# EAGLE design B166X (EAGLE 6.6.0)
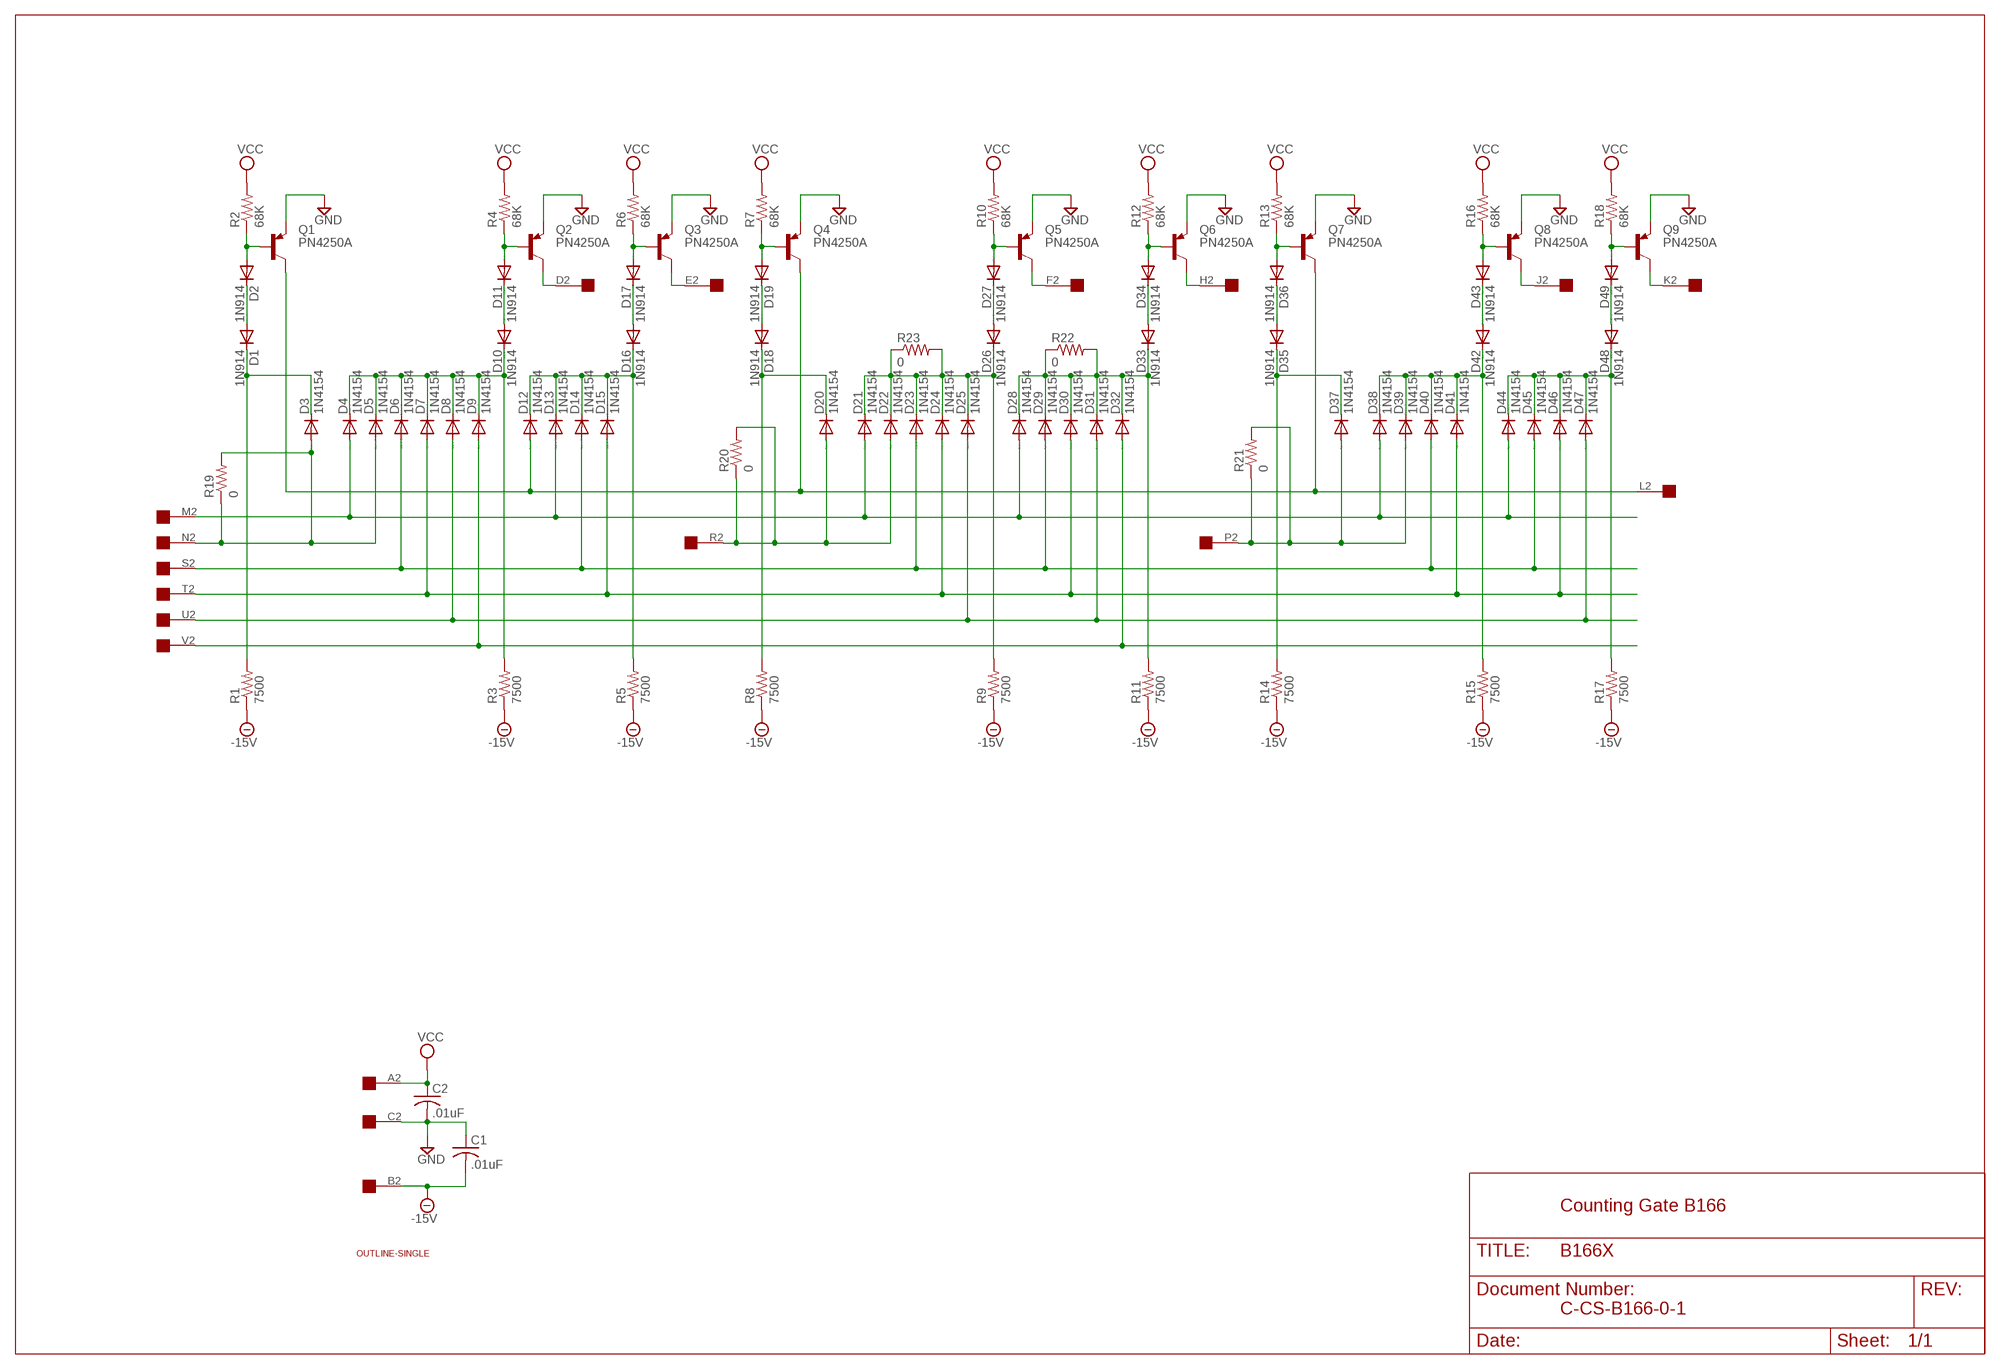
[diagram p0: schematic, sheet 1]

## Parts
C1  .01uF  C-US  [C063-025X075]
C2  .01uF  C-US  [C063-025X075]
D1  1N914  DIODE-DO35-10  [DO35-10]
D2  1N914  DIODE-DO35-10  [DO35-10]
D3  1N4154  DIODE-DO35-10  [DO35-10]
D4  1N4154  DIODE-DO35-10  [DO35-10]
D5  1N4154  DIODE-DO35-10  [DO35-10]
D6  1N4154  DIODE-DO35-10  [DO35-10]
D7  1N4154  DIODE-DO35-10  [DO35-10]
D8  1N4154  DIODE-DO35-10  [DO35-10]
D9  1N4154  DIODE-DO35-10  [DO35-10]
D10  1N914  DIODE-DO35-10  [DO35-10]
D11  1N914  DIODE-DO35-10  [DO35-10]
D12  1N4154  DIODE-DO35-10  [DO35-10]
D13  1N4154  DIODE-DO35-10  [DO35-10]
D14  1N4154  DIODE-DO35-10  [DO35-10]
D15  1N4154  DIODE-DO35-10  [DO35-10]
D16  1N914  DIODE-DO35-10  [DO35-10]
D17  1N914  DIODE-DO35-10  [DO35-10]
D18  1N914  DIODE-DO35-10  [DO35-10]
D19  1N914  DIODE-DO35-10  [DO35-10]
D20  1N4154  DIODE-DO35-10  [DO35-10]
D21  1N4154  DIODE-DO35-10  [DO35-10]
D22  1N4154  DIODE-DO35-10  [DO35-10]
D23  1N4154  DIODE-DO35-10  [DO35-10]
D24  1N4154  DIODE-DO35-10  [DO35-10]
D25  1N4154  DIODE-DO35-10  [DO35-10]
D26  1N914  DIODE-DO35-10  [DO35-10]
D27  1N914  DIODE-DO35-10  [DO35-10]
D28  1N4154  DIODE-DO35-10  [DO35-10]
D29  1N4154  DIODE-DO35-10  [DO35-10]
D30  1N4154  DIODE-DO35-10  [DO35-10]
D31  1N4154  DIODE-DO35-10  [DO35-10]
D32  1N4154  DIODE-DO35-10  [DO35-10]
D33  1N914  DIODE-DO35-10  [DO35-10]
D34  1N914  DIODE-DO35-10  [DO35-10]
D35  1N914  DIODE-DO35-10  [DO35-10]
D36  1N914  DIODE-DO35-10  [DO35-10]
D37  1N4154  DIODE-DO35-10  [DO35-10]
D38  1N4154  DIODE-DO35-10  [DO35-10]
D39  1N4154  DIODE-DO35-10  [DO35-10]
D40  1N4154  DIODE-DO35-10  [DO35-10]
D41  1N4154  DIODE-DO35-10  [DO35-10]
D42  1N914  DIODE-DO35-10  [DO35-10]
D43  1N914  DIODE-DO35-10  [DO35-10]
D44  1N4154  DIODE-DO35-10  [DO35-10]
D45  1N4154  DIODE-DO35-10  [DO35-10]
D46  1N4154  DIODE-DO35-10  [DO35-10]
D47  1N4154  DIODE-DO35-10  [DO35-10]
D48  1N914  DIODE-DO35-10  [DO35-10]
D49  1N914  DIODE-DO35-10  [DO35-10]
Q1  PN4250A  -PNP-TO5  [TO5]
Q2  PN4250A  -PNP-TO5  [TO5]
Q3  PN4250A  -PNP-TO5  [TO5]
Q4  PN4250A  -PNP-TO5  [TO5]
Q5  PN4250A  -PNP-TO5  [TO5]
Q6  PN4250A  -PNP-TO5  [TO5]
Q7  PN4250A  -PNP-TO5  [TO5]
Q8  PN4250A  -PNP-TO5  [TO5]
Q9  PN4250A  -PNP-TO5  [TO5]
R1  7500  R-US_0207/10  [0207/10]
R2  68K  R-US_0207/10  [0207/10]
R3  7500  R-US_0207/10  [0207/10]
R4  68K  R-US_0207/10  [0207/10]
R5  7500  R-US_0207/10  [0207/10]
R6  68K  R-US_0207/10  [0207/10]
R7  68K  R-US_0207/10  [0207/10]
R8  7500  R-US_0207/10  [0207/10]
R9  7500  R-US_0207/10  [0207/10]
R10  68K  R-US_0207/10  [0207/10]
R11  7500  R-US_0207/10  [0207/10]
R12  68K  R-US_0207/10  [0207/10]
R13  68K  R-US_0207/10  [0207/10]
R14  7500  R-US_0207/10  [0207/10]
R15  7500  R-US_0207/10  [0207/10]
R16  68K  R-US_0207/10  [0207/10]
R17  7500  R-US_0207/10  [0207/10]
R18  68K  R-US_0207/10  [0207/10]
R19  0  R-US_0207/10  [0207/10]
R20  0  R-US_0207/10  [0207/10]
R21  0  R-US_0207/10  [0207/10]
R22  0  R-US_0207/10  [0207/10]
R23  0  R-US_0207/10  [0207/10]
U$1  OUTLINE-SINGLE  [SINGLE]
U$2  EDGE-1  [EDGE-CON1]

## Nets
-15V: C1.2 R1.1 R3.1 R5.1 R8.1 R9.1 R11.1 R14.1 R15.1 R17.1 U$2.B2
GND: C1.1 C2.2 Q1.1(E) Q2.1(E) Q3.1(E) Q4.1(E) Q5.1(E) Q6.1(E) Q7.1(E) Q8.1(E) Q9.1(E) U$2.C2
N$1: D2.A Q1.2(B) R2.1
N$2: D1.A D2.C
N$3: D1.C D3.C R1.2
N$4: D3.A D5.A R19.1 R19.2 U$2.N2
N$5: D4.C D5.C D6.C D7.C D8.C D9.C D10.C R3.2
N$6: D12.A Q1.3(C) Q4.3(C) Q7.3(C) U$2.L2
N$7: D4.A D13.A D21.A D28.A D38.A D44.A U$2.M2
N$8: D8.A D25.A D31.A D47.A U$2.U2
N$9: D7.A D15.A D24.A D30.A D41.A D46.A U$2.T2
N$10: D11.A Q2.2(B) R4.1
N$11: D9.A D32.A U$2.V2
N$12: D6.A D14.A D23.A D29.A D40.A D45.A U$2.S2
N$13: D10.A D11.C
N$14: Q2.3(C) U$2.D2
N$15: D19.A Q4.2(B) R7.1
N$16: D12.C D13.C D14.C D15.C D16.C R5.2
N$17: D18.A D19.C
N$18: D18.C D20.C R8.2
N$19: D20.A D22.A R20.1 R20.2 U$2.R2
N$20: D21.C D22.C D23.C D24.C D25.C D26.C R9.2 R23.1 R23.2
N$23: D17.A Q3.2(B) R6.1
N$24: D16.A D17.C
N$25: Q3.3(C) U$2.E2
N$30: D27.A Q5.2(B) R10.1
N$31: D26.A D27.C
N$32: Q5.3(C) U$2.F2
N$33: D28.C D29.C D30.C D31.C D32.C D33.C R11.2 R22.1 R22.2
N$34: D34.A Q6.2(B) R12.1
N$35: D33.A D34.C
N$36: Q6.3(C) U$2.H2
N$37: D36.A Q7.2(B) R13.1
N$38: D35.A D36.C
N$39: D35.C D37.C R14.2
N$40: D37.A D39.A R21.1 R21.2 U$2.P2
N$41: D38.C D39.C D40.C D41.C D42.C R15.2
N$42: D43.A Q8.2(B) R16.1
N$43: D42.A D43.C
N$44: Q8.3(C) U$2.J2
N$45: D44.C D45.C D46.C D47.C D48.C R17.2
N$46: D49.A Q9.2(B) R18.1
N$47: D48.A D49.C
N$48: Q9.3(C) U$2.K2
VCC: C2.1 R2.2 R4.2 R6.2 R7.2 R10.2 R12.2 R13.2 R16.2 R18.2 U$2.A2

## Notes on the sheet
- Counting Gate B166
- C-CS-B166-0-1

## Library data of the parts
C1 C2 = dec-con:C-US: Capacitors with funky DEC lead spacing.
D1-D49 = diode:DIODE-: DIODE
Q1-Q9 = transistor:*-PNP-: PNP Transistror
R1-R23 = rcl:R-US_: RESISTOR, American symbol
U$1 = dec-con:OUTLINE-*: Board outlines for DEC boards.
U$2 = dec-con:EDGE-1: Single-Sided DEC Edge Connector -- (side 2)

## Board
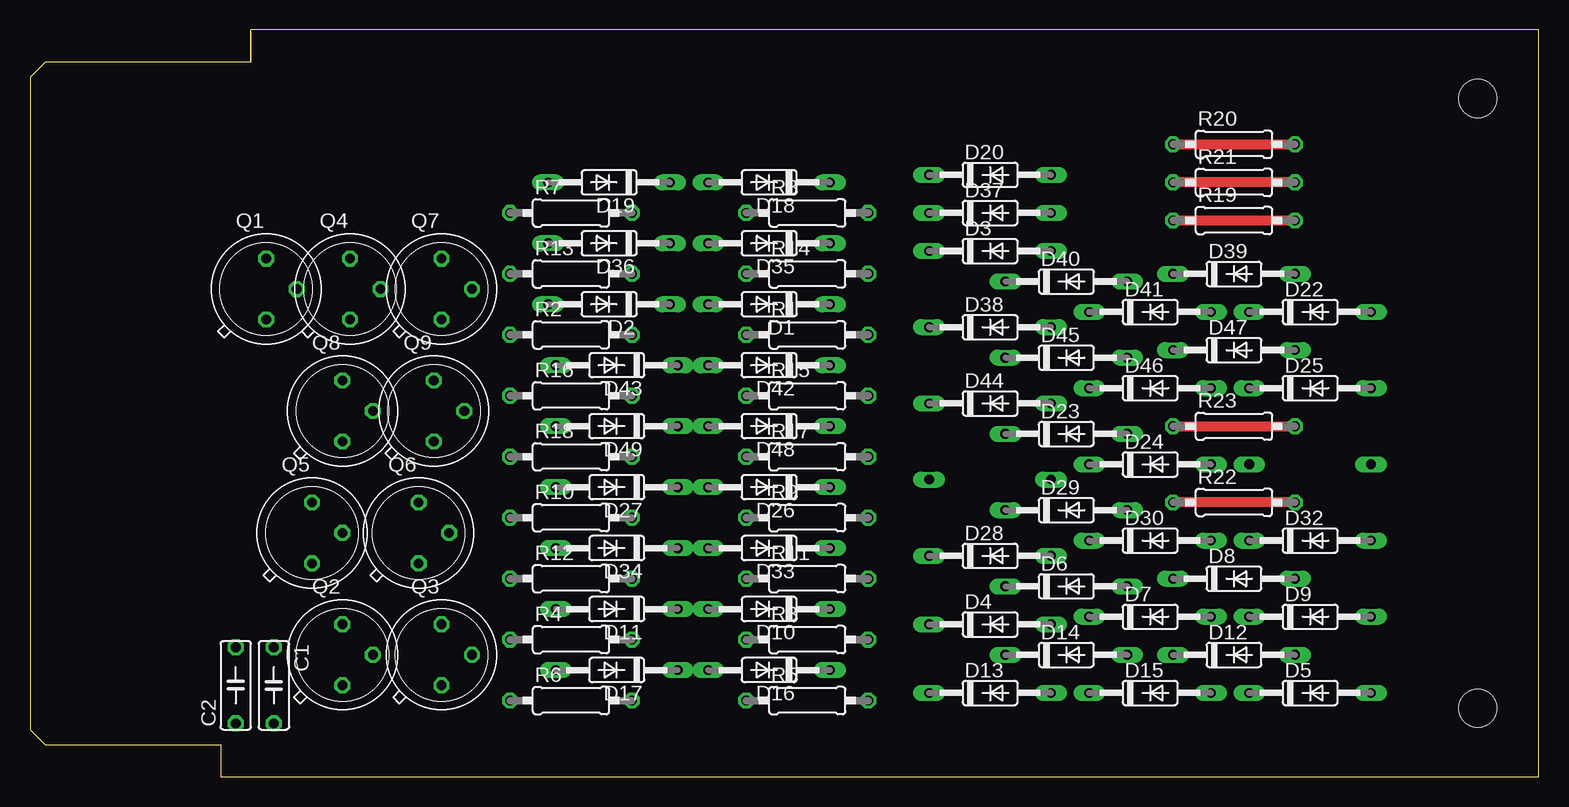
[diagram p1: board, top side]
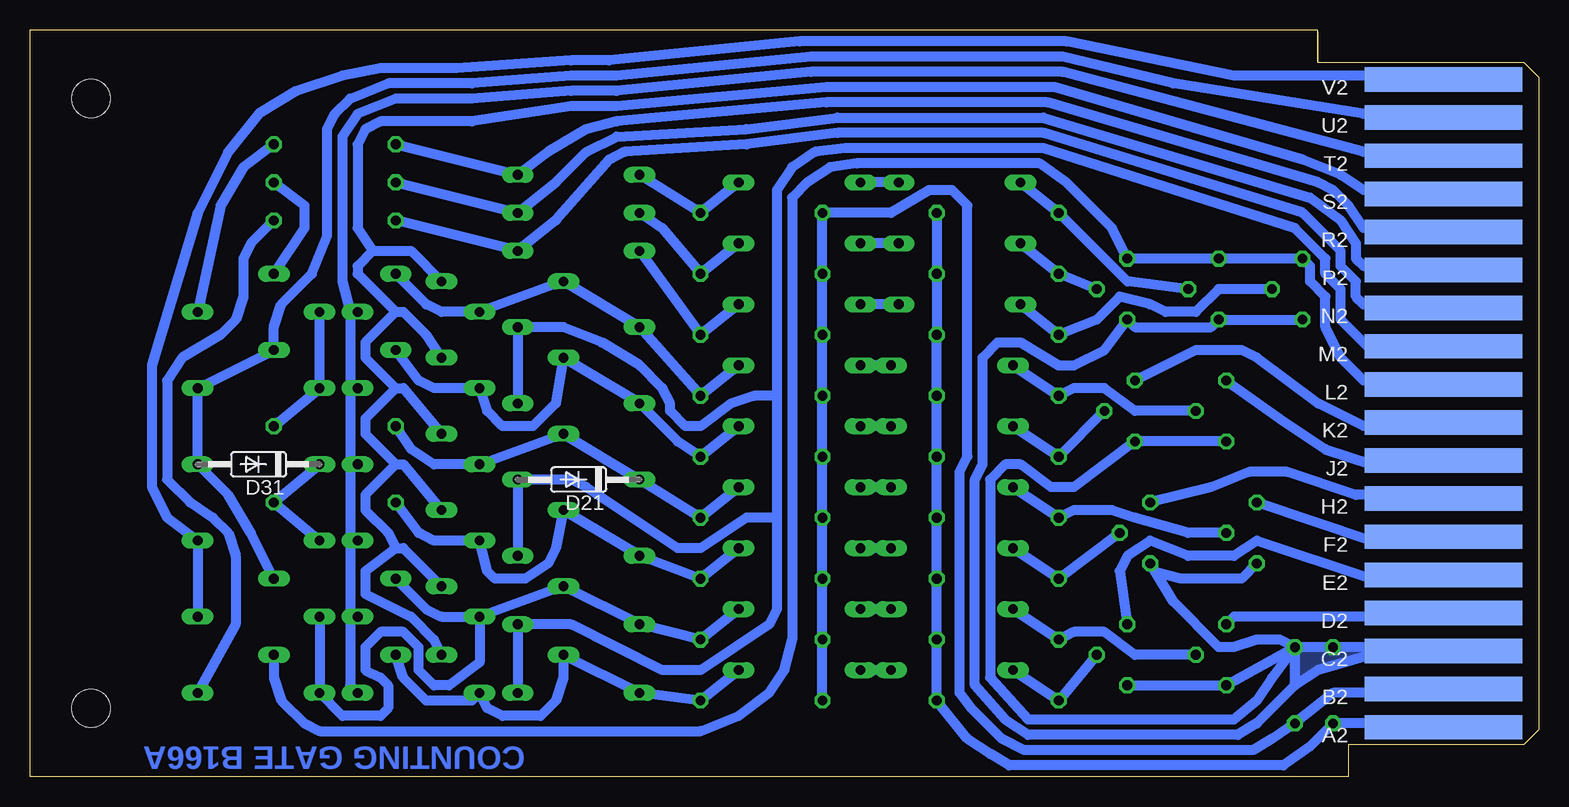
[diagram p2: board, bottom side, seen from below]

Size 125.73 x 62.23 mm. Coordinates in mm from the lower left corner, seen from the top.
Copper layers (1+16): Top 0.035mm / dielectric 1.5mm / Bottom 0.035mm
Design rules "16mils": minimum track width 16mil, minimum drill 32mil, track to track 15mil, track to pad 10mil, pad to pad 10mil, via to via 10mil, smd to smd 10mil, copper to edge 13mil, drill to drill 10mil, minimum pad ring 10mil, minimum via ring 8mil, stop-mask expansion 0mil, vias tented up to drill 0mil, thermal gap 10mil

### Footprints (pad centres in the part's own frame; a part is rotated, then mirrored left to right if it is on the bottom)
C063-025X075 = drill 0.813 octagon: 1 -2.54,0; 2 3.81,0
DO35-10 = drill 0.813 long: A 5.08,0; C -5.08,0
TO5 = drill 0.813 octagon: 1 0,-2.54; 2 2.54,0; 3 0,2.54
0207/10 = drill 0.813 octagon: 1 -5.08,0; 2 5.08,0
SINGLE = hole 3.175: 120.65,56.515; 120.65,5.715
EDGE-CON1 = smd 13.106 x 2.032 bottom: A2 7.938,4.128; B2 7.938,7.303; C2 7.938,10.477; D2 7.938,13.652; E2 7.938,16.828; F2 7.938,20.003; H2 7.938,23.177; J2 7.938,26.352; K2 7.938,29.527; L2 7.938,32.703; M2 7.938,35.877; N2 7.938,39.053; P2 7.938,42.227; R2 7.938,45.403; S2 7.938,48.578; T2 7.938,51.752; U2 7.938,54.928; V2 7.938,58.102

### Placement (x,y rotation side)
C1  20.32,8.26 270 top
C2  17.15,6.99 90 top
D1  61.6,39.37 180 top
D2  48.26,39.37 180 top
D3  80.01,43.81 0 top
D4  80.01,12.7 0 top
D5  106.68,6.99 0 top
D6  86.36,15.88 0 top
D7  93.35,13.34 0 top
D8  100.33,16.51 0 top
D9  106.68,13.34 0 top
D10  61.6,13.97 180 top
D11  48.9,13.97 180 top
D12  100.33,10.16 0 top
D13  80.01,6.99 0 top
D14  86.36,10.16 0 top
D15  93.35,6.99 0 top
D16  61.6,8.89 180 top
D17  48.9,8.89 180 top
D18  61.6,49.53 180 top
D19  48.26,49.53 180 top
D20  80.01,50.16 0 top
D21  80.01,24.77 180 bottom
D22  106.68,38.73 0 top
D23  86.36,28.57 0 top
D24  93.35,26.04 0 top
D25  106.68,32.38 0 top
D26  61.6,24.13 180 top
D27  48.9,24.13 180 top
D28  80.01,18.41 0 top
D29  86.36,22.23 0 top
D30  93.35,19.68 0 top
D31  106.68,26.04 180 bottom
D32  106.68,19.68 0 top
D33  61.6,19.05 180 top
D34  48.9,19.05 180 top
D35  61.6,44.45 180 top
D36  48.26,44.45 180 top
D37  80.01,46.99 0 top
D38  80.01,37.47 0 top
D39  100.33,41.91 0 top
D40  86.36,41.27 0 top
D41  93.35,38.73 0 top
D42  61.6,34.29 180 top
D43  48.9,34.29 180 top
D44  80.01,31.11 0 top
D45  86.36,34.92 0 top
D46  93.35,32.38 0 top
D47  100.33,35.56 0 top
D48  61.6,29.21 180 top
D49  48.9,29.21 180 top
Q1  19.69,40.64 0 top
Q2  26.04,10.16 0 top
Q3  34.29,10.16 0 top
Q4  26.67,40.64 0 top
Q5  23.5,20.32 0 top
Q6  32.39,20.32 0 top
Q7  34.29,40.64 0 top
Q8  26.04,30.48 0 top
Q9  33.66,30.48 0 top
R1  64.77,36.83 0 top
R2  45.09,36.83 0 top
R3  64.77,11.43 0 top
R4  45.09,11.43 0 top
R5  64.77,6.35 0 top
R6  45.09,6.35 0 top
R7  45.09,46.99 0 top
R8  64.77,46.99 0 top
R9  64.77,21.59 0 top
R10  45.09,21.59 0 top
R11  64.77,16.51 0 top
R12  45.09,16.51 0 top
R13  45.09,41.91 0 top
R14  64.77,41.91 0 top
R15  64.77,31.75 0 top
R16  45.09,31.75 0 top
R17  64.77,26.67 0 top
R18  45.09,26.67 0 top
R19  100.33,46.35 0 top
R20  100.33,52.7 0 top
R21  100.33,49.53 0 top
R22  100.33,22.86 0 top
R23  100.33,29.21 0 top
U$1  0,0 0 top
U$2  0,0 0 top

### Tracks (layer width: path | path; a pad name or v marks a point on that pad's centre or on a via)
-15V
  Bottom 0.813: U$2.B2 8.89,6.99 17.15,6.99 C1.2 22.23,3.17 23.81,2.22 42.86,2.22 44.77,3.17 47.31,5.71 48.26,6.99 48.26,25.4 47.63,26.67 47.63,47.62 48.9,48.9 50.8,48.9 53.98,46.99 R8.1 R14.1 R1.1 R15.1 R17.1 R9.1 R11.1 R3.1 R5.1
GND
  Bottom 0.813: U$2.C2 8.89,10.16 13.97,10.16 | 13.97,10.16 18.42,8.89 20.32,7.62 | 20.32,7.62 23.5,4.45 25.08,3.49 42.55,3.49 44.45,4.76 46.99,7.62 46.99,24.77 46.36,26.04 46.36,34.92 45.09,36.2 43.18,36.2 40.01,34.29 38.74,34.29 36.2,35.56 Q7.1 33.66,37.47 27.31,37.47 Q4.1 Q1.1 | C1.1 22.23,8.26 23.5,6.35 25.4,4.76 42.55,4.76 45.72,8.26 45.72,24.77 44.45,26.04 43.18,26.04 40.64,24.13 38.74,24.13 Q9.1 Q8.1 | C1.1 Q2.1 Q3.1 | C1.1 C2.2 13.97,10.79 13.97,10.16 | C1.1 20.32,7.62 | C1.1 21.59,11.43 23.5,11.43 25.4,10.79 26.67,10.79 30.48,14.61 31.94,17.03 | 31.94,17.03 Q6.1 | Q5.1 24.77,16.51 29.85,16.51 31.94,17.03
  pour Bottom (no thermals): 13.97,10.79 13.97,10.16 18.42,8.89 20.32,7.62 20.32,10.79
N$1
  Bottom 0.813: D2.A R2.1 36.83,38.1 34.93,40.01 32.39,39.37 31.12,38.73 28.58,38.73 26.67,40.64 Q1.2
N$2
  Bottom 0.813: D2.C D1.A
N$3
  Bottom 0.813: D1.C R1.2 D3.C
N$4
  Top 0.813: R19.1 R19.2
  Bottom 0.813: U$2.N2 8.89,39.37 14.61,39.37 15.24,40.01 15.24,41.27 16.51,42.55 16.51,43.81 19.69,46.99 41.28,53.66 58.42,53.66 66.04,52.7 76.2,52.07 77.47,51.44 81.92,46.35 D3.A R19.1 | R19.2 107.32,44.45 107.95,43.18 107.95,40.01 108.59,38.1 109.86,36.83 113.03,34.92 114.3,33.02 114.3,24.77 112.4,22.86 110.49,21.59 109.22,20.32 108.59,18.41 108.59,12.7 D5.A
N$5
  Bottom 0.813: D10.C R3.2 D4.C D6.C D7.C | D7.C 88.27,9.53 90.81,7.62 92.08,7.62 93.35,8.89 93.35,10.79 94.62,12.06 96.52,12.06 97.79,10.79 97.79,8.89 96.52,8.26 95.89,7.62 95.89,5.71 96.52,5.08 99.7,5.08 D5.C D9.C | D8.C 92.71,13.97 91.44,13.34 D7.C
N$6
  Bottom 0.813: U$2.L2 8.89,33.02 14.61,33.02 16.51,34.92 17.78,37.47 17.78,40.01 19.05,41.27 19.05,42.55 Q1.3 Q4.3 Q7.3 35.56,45.72 39.37,49.53 41.59,51.12 56.83,51.12 59.06,50.8 60.96,49.53 62.23,48.26 62.23,11.43 62.87,8.89 64.14,6.99 66.68,5.08 69.85,3.81 101.6,3.81 102.87,4.45 104.78,6.35 105.41,8.26 D12.A
N$7
  Bottom 0.813: U$2.M2 8.89,35.56 13.97,35.56 16.51,38.1 16.51,40.64 17.78,41.91 17.78,43.18 20.32,45.72 41.28,52.39 57.79,52.39 60.33,52.07 62.23,50.8 63.5,48.9 63.5,31.75 | 63.5,31.75 63.5,21.59 | 63.5,21.59 63.5,13.97 64.14,12.7 69.85,8.89 73.03,8.89 80.65,12.7 D4.A D13.A | 63.5,31.75 65.41,31.75 67.31,31.11 69.85,29.21 71.12,29.21 72.39,30.48 72.39,31.11 73.03,32.38 74.93,34.29 78.11,36.2 81.28,37.47 D38.A D44.A | 63.5,21.59 66.04,21.59 69.85,19.05 71.76,19.05 79.38,24.13 80.65,24.77 D21.A D28.A
N$8
  Bottom 0.813: U$2.U2 8.89,55.24 14.61,55.24 30.48,57.78 39.69,60.01 60.64,60.01 76.84,58.42 80.65,58.42 88.9,57.78 95.89,57.78 99.06,56.52 100.33,55.24 100.97,53.98 100.97,45.09 102.24,41.91 104.78,39.37 105.41,37.47 D47.A D25.A D31.A 109.22,23.5 107.32,20.32 D8.A
N$9
  Bottom 0.813: U$2.T2 8.89,52.07 14.61,52.07 39.69,58.74 60.64,58.74 76.84,57.15 80.65,57.15 88.9,56.52 95.25,56.52 98.43,55.24 99.7,53.34 99.7,41.27 99.06,38.73 | D41.A 99.06,38.73 | 99.06,38.73 99.06,32.38 | 99.06,32.38 99.06,26.04 | 99.06,26.04 99.06,19.68 | 99.06,19.68 99.06,13.34 | 99.06,13.34 99.06,7.62 D15.A | D7.A 99.06,13.34 | D30.A 99.06,19.68 | D24.A 99.06,26.04 | D46.A 99.06,32.38
N$10
  Bottom 0.813: Q2.2 33.66,10.16 36.2,12.06 38.74,12.06 R4.1 D11.A
N$11
  Bottom 0.813: U$2.V2 8.89,58.42 25.4,58.42 39.37,61.28 61.6,61.28 77.47,59.69 80.65,59.69 90.17,59.05 96.52,59.05 99.7,58.42 103.51,57.15 106.68,55.24 109.22,52.07 111.76,46.99 115.57,34.29 115.57,24.13 114.3,21.59 D32.A D9.A
N$12
  Bottom 0.813: U$2.S2 8.26,48.9 14.61,48.9 16.51,50.16 19.69,51.44 40.32,57.47 59.37,57.47 76.84,55.88 80.65,55.88 88.9,54.61 96.52,54.61 97.79,53.98 98.43,52.7 98.43,45.72 97.16,43.81 | 97.16,43.81 93.98,43.81 D40.A | 97.16,43.81 98.43,42.55 98.43,41.91 95.25,38.73 | 95.25,38.73 94.62,38.73 92.71,36.83 D45.A | 95.25,38.73 97.79,36.2 97.79,34.92 95.25,32.38 | 95.25,32.38 94.62,32.38 D23.A | 95.25,32.38 97.79,29.84 97.79,28.57 95.25,26.04 | 95.25,26.04 94.62,26.04 D29.A | 95.25,26.04 97.79,23.5 97.79,22.23 95.89,20.32 95.25,19.05 | 95.25,19.05 94.62,19.05 D6.A | 95.25,19.05 97.79,17.14 97.79,15.24 93.98,13.34 92.08,11.43 D14.A
N$13
  Bottom 0.813: D11.C D10.A
N$14
  Bottom 0.813: U$2.D2 8.89,13.34 25.4,13.34 Q2.3
N$15
  Bottom 0.813: D19.A R7.1 34.29,41.27 Q4.2
N$16
  Bottom 0.813: D16.C R5.2 D13.C D14.C 81.28,8.26 81.92,6.35 83.19,5.08 86.36,5.08 87.63,5.71 D15.C 88.9,6.35 92.71,6.35 94.62,8.26 D12.C
N$17
  Bottom 0.813: D19.C D18.A
N$18
  Bottom 0.813: D18.C R8.2 D20.C
N$19
  Top 0.813: R20.1 R20.2
  Bottom 0.813: R20.1 D20.A 82.55,52.07 79.38,53.98 76.84,54.61 59.37,56.2 40.96,56.2 18.42,49.53 17.15,48.9 15.88,47.62 14.61,45.72 8.26,45.72 U$2.R2 | R20.2 107.95,50.8 109.86,47.62 D22.A
N$20
  Top 0.813: R23.1 R23.2
  Bottom 0.813: D26.C R9.2 D21.C D23.C D24.C 92.08,26.04 93.98,27.3 R23.1 | R23.2 D25.C D22.C
N$23
  Bottom 0.813: Q3.2 R6.1 D17.A
N$24
  Bottom 0.813: D17.C D16.A
N$25
  Bottom 0.813: U$2.E2 8.89,16.51 13.97,16.51 23.5,19.68 25.4,18.41 29.21,18.41 32.39,19.68 34.29,18.41 34.93,17.14 Q3.3
N$30
  Bottom 0.813: D27.A R10.1 38.74,22.23 35.56,22.23 33.66,21.59 29.21,20.32 Q5.2
N$31
  Bottom 0.813: D27.C D26.A
N$32
  Bottom 0.813: Q5.3 13.97,19.68 8.89,19.68 U$2.F2
N$33
  Top 0.813: R22.2 R22.1
  Bottom 0.813: D33.C R11.2 D28.C D29.C 81.92,19.05 82.55,17.78 84.46,16.51 87,16.51 87.63,17.14 D30.C 92.08,19.68 93.35,20.32 R22.1 | D32.C R22.2 D31.C
N$34
  Bottom 0.813: Q6.2 R12.1 D34.A
N$35
  Bottom 0.813: D34.C D33.A
N$36
  Bottom 0.813: U$2.H2 8.26,23.5 15.24,23.5 20.96,25.4 24.13,25.4 27.31,24.13 Q6.3
N$37
  Bottom 0.813: Q7.2 R13.1 D36.A
N$38
  Bottom 0.813: D36.C D35.A
N$39
  Bottom 0.813: D35.C R14.2 73.03,45.72 D37.C
N$40
  Top 0.813: R21.2 R21.1
  Bottom 0.813: R21.1 D37.A 81.92,49.53 79.38,52.07 76.84,53.34 66.04,53.98 58.42,54.93 41.28,54.93 19.05,48.26 16.51,46.35 15.24,44.45 15.24,43.18 14.61,42.55 8.89,42.55 U$2.P2 | R21.2 102.87,47.62 102.87,45.72 D39.A
N$41
  Bottom 0.813: D42.C R15.2 D38.C D40.C D41.C 91.44,38.73 92.71,39.37 D39.C
N$42
  Bottom 0.813: D43.A R16.1 38.74,32.38 36.2,32.38 33.66,30.48 Q8.2
N$43
  Bottom 0.813: D43.C D42.A
N$44
  Bottom 0.813: Q8.3 21.59,29.84 17.78,27.3 13.97,26.04 8.26,26.04 U$2.J2
N$45
  Bottom 0.813: D48.C R17.2 71.76,27.94 D44.C D45.C 81.92,31.11 83.82,29.21 86.36,29.21 87.63,30.48 D46.C 92.08,32.38 93.35,33.02 D47.C
N$46
  Bottom 0.813: Q9.2 R18.1 D49.A
N$47
  Bottom 0.813: D49.C D48.A
N$48
  Bottom 0.813: U$2.K2 8.89,29.21 14.61,29.21 18.42,31.11 23.5,34.92 24.77,35.56 28.58,35.56 Q9.3
VCC
  Bottom 0.813: U$2.A2 8.89,4.45 C2.1 19.05,2.54 21.27,0.95 44.13,0.95 45.72,1.91 47.63,3.17 R6.2 R4.2 R12.2 R10.2 R18.2 R16.2 R2.2 R13.2 R7.2

### Text on the board
Bottom: COUNTING GATE | B166A